# Altium schematic sheet blokdiyagramı.SchDoc
size A3; Engineer: Sinan SAVUCU; DocumentNumber: 1; SheetNumber: 1; SheetTotal: 4
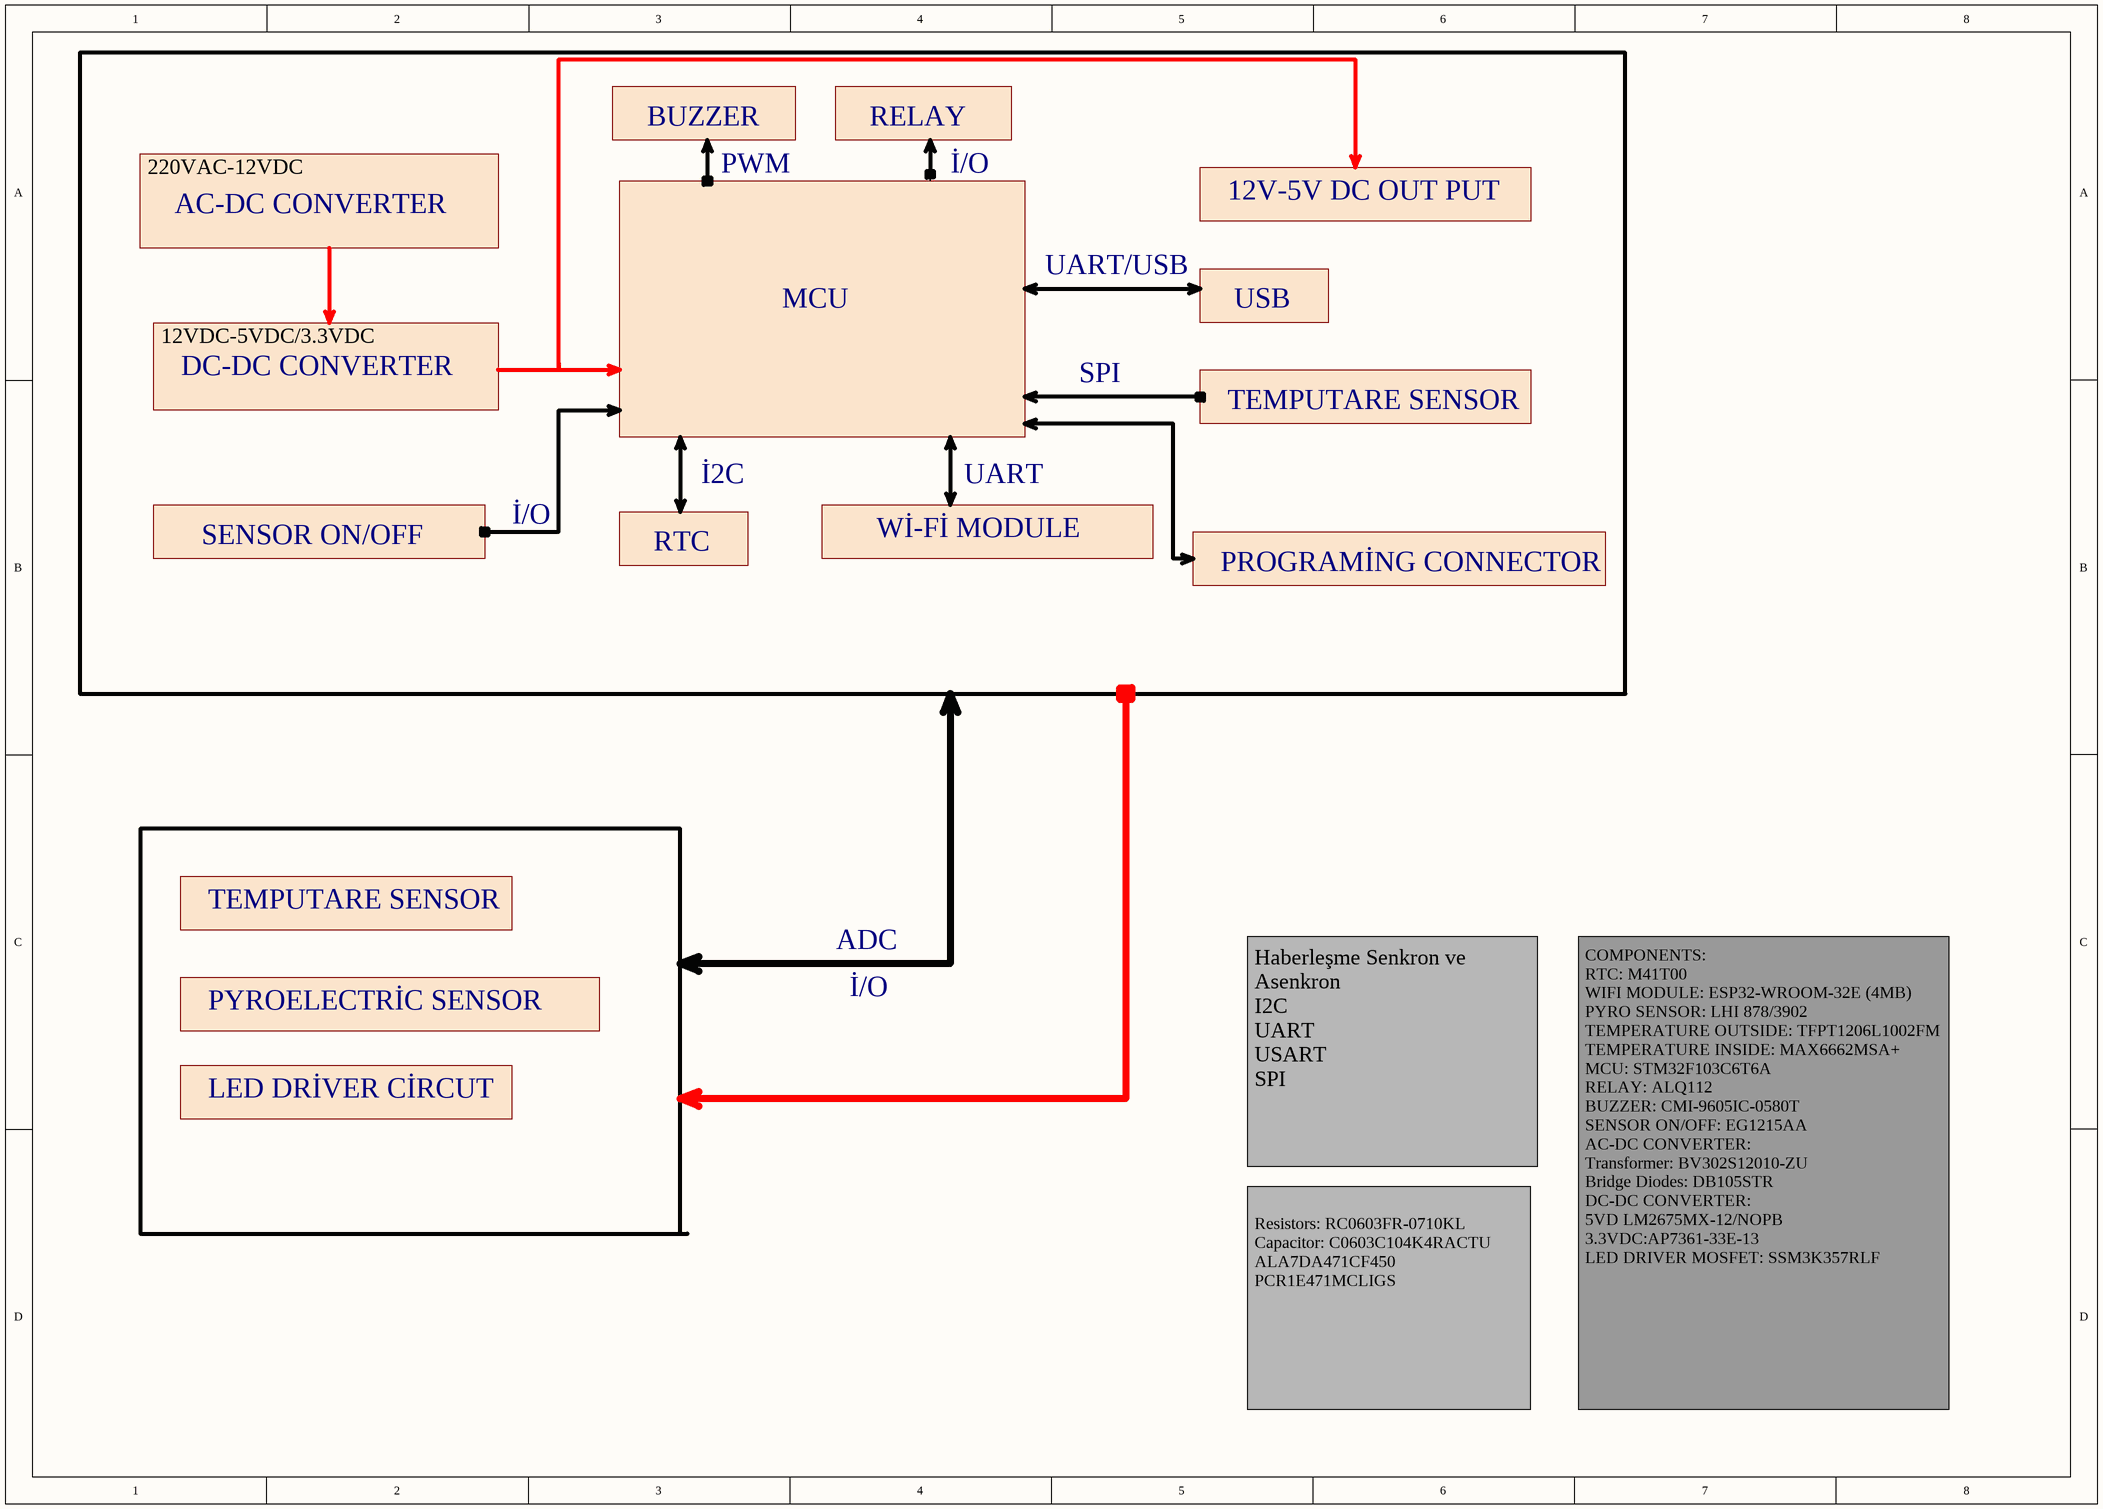
[diagram p0: blokdiyagramı.SchDoc]

## Sub-sheets
12V-5V DC OUT PUT = File Name: no entries
AC-DC CONVERTER = File Name: no entries
BUZZER = File Name: no entries
DC-DC CONVERTER = File Name: no entries
LED DRİVER CİRCUT = File Name: no entries
MCU = File Name: no entries
PROGRAMİNG CONNECTOR = File Name: no entries
PYROELECTRİC SENSOR = File Name: no entries
RELAY = File Name: no entries
RTC = File Name: no entries
SENSOR ON/OFF = File Name: no entries
TEMPUTARE SENSOR = File Name: no entries
TEMPUTARE SENSOR = File Name: no entries
USB = File Name: no entries
Wİ-Fİ MODULE = File Name: no entries

## Notes on the sheet
- 220VAC-12VDC
- PWM
- İ/O
- UART/USB
- 12VDC-5VDC/3.3VDC
- SPI
- İ2C
- UART
- ADC
- Haberleşme Senkron ve Asenkron
  I2C
  UART
  USART
  SPI
- Resistors: RC0603FR-0710KL
  Capacitor: C0603C104K4RACTU
  ALA7DA471CF450
  PCR1E471MCLIGS
- COMPONENTS:
  RTC: M41T00
  WIFI MODULE: ESP32-WROOM-32E (4MB)
  PYRO SENSOR: LHI 878/3902
  TEMPERATURE OUTSIDE: TFPT1206L1002FM
  TEMPERATURE INSIDE: MAX6662MSA+
  MCU: STM32F103C6T6A
  RELAY: ALQ112
  BUZZER: CMI-9605IC-0580T
  SENSOR ON/OFF: EG1215AA
  AC-DC CONVERTER:
  Transformer: BV302S12010-ZU
  Bridge Diodes: DB105STR
  DC-DC CONVERTER:
  5VD LM2675MX-12/NOPB
  3.3VDC:AP7361-33E-13
  LED DRIVER MOSFET: SSM3K357RLF